# Altium schematic sheet FMC_connector_A.SchDoc
size A
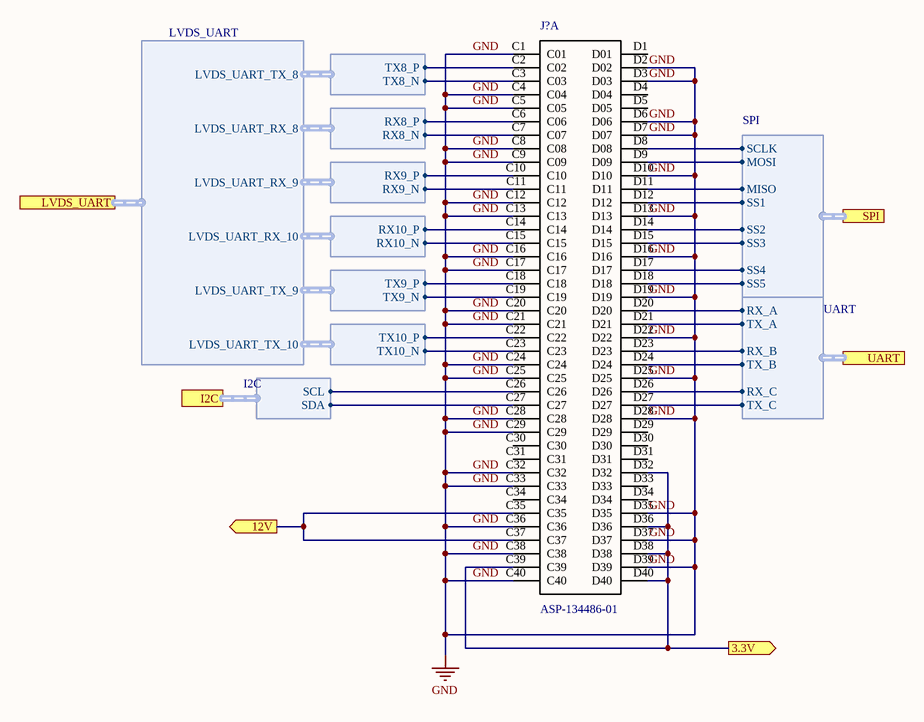
[diagram p0: FMC_connector_A.SchDoc]

## Parts
J?  ASP-134486-01  [*SAMTEC_ASP-134486-01_ASP-134486-01(Primary)]  (part A of 5)

## Ports
3.3V (out), 12V (out), I2C (harness I2C), LVDS_UART (harness LVDS_UART), SPI (harness SPI), UART (harness UART)

## Harnesses
I2C: SCL, SDA
SPI: SS1, SS2, MOSI, MISO, SCLK, SS3, SS4, SS5
UART: RX_A, TX_A, RX_B, TX_B, RX_C, TX_C
LVDS_UART_RX_8: RX8_P, RX8_N
LVDS_UART_RX_9: RX9_P, RX9_N
LVDS_UART_RX_10: RX10_P, RX10_N
LVDS_UART_TX_8: TX8_P, TX8_N
LVDS_UART_TX_9: TX9_P, TX9_N
LVDS_UART_TX_10: TX10_P, TX10_N
LVDS_UART: LVDS_UART_TX_8, LVDS_UART_RX_8, LVDS_UART_RX_9, LVDS_UART_RX_10, LVDS_UART_TX_9, LVDS_UART_TX_10

## Nets
GND: J?.C1(C01) J?.C4(C04) J?.C5(C05) J?.C8(C08) J?.C9(C09) J?.C12 J?.C13 J?.C16 J?.C17 J?.C20 J?.C21 J?.C24 J?.C25 J?.C28 J?.C29 J?.C32 J?.C33 J?.C36 J?.C38 J?.C40 J?.D2(D02) J?.D3(D03) J?.D6(D06) J?.D7(D07) J?.D10 J?.D13 J?.D16 J?.D19 J?.D22 J?.D25 J?.D28 J?.D35 J?.D37 J?.D39
3.3V: J?.C39 J?.D32 J?.D36 J?.D38 J?.D40 ; port 3.3V
12V: J?.C35 J?.C37 ; port 12V
NetJ?_C2: J?.C2(C02) ; harness LVDS_UART_TX_8.TX8_P
NetJ?_C3: J?.C3(C03) ; harness LVDS_UART_TX_8.TX8_N
NetJ?_C6: J?.C6(C06) ; harness LVDS_UART_RX_8.RX8_P
NetJ?_C7: J?.C7(C07) ; harness LVDS_UART_RX_8.RX8_N
NetJ?_C10: J?.C10 ; harness LVDS_UART_RX_9.RX9_P
NetJ?_C11: J?.C11 ; harness LVDS_UART_RX_9.RX9_N
NetJ?_C14: J?.C14 ; harness LVDS_UART_RX_10.RX10_P
NetJ?_C15: J?.C15 ; harness LVDS_UART_RX_10.RX10_N
NetJ?_C18: J?.C18 ; harness LVDS_UART_TX_9.TX9_P
NetJ?_C19: J?.C19 ; harness LVDS_UART_TX_9.TX9_N
NetJ?_C22: J?.C22 ; harness LVDS_UART_TX_10.TX10_P
NetJ?_C23: J?.C23 ; harness LVDS_UART_TX_10.TX10_N
NetJ?_C26: J?.C26 ; port I2C.SCL
NetJ?_C27: J?.C27 ; port I2C.SDA
NetJ?_D8: J?.D8(D08) ; port SPI.SCLK
NetJ?_D9: J?.D9(D09) ; port SPI.MOSI
NetJ?_D11: J?.D11 ; port SPI.MISO
NetJ?_D12: J?.D12 ; port SPI.SS1
NetJ?_D14: J?.D14 ; port SPI.SS2
NetJ?_D15: J?.D15 ; port SPI.SS3
NetJ?_D17: J?.D17 ; port SPI.SS4
NetJ?_D18: J?.D18 ; port SPI.SS5
NetJ?_D20: J?.D20 ; port UART.RX_A
NetJ?_D21: J?.D21 ; port UART.TX_A
NetJ?_D23: J?.D23 ; port UART.RX_B
NetJ?_D24: J?.D24 ; port UART.TX_B
NetJ?_D26: J?.D26 ; port UART.RX_C
NetJ?_D27: J?.D27 ; port UART.TX_C

Not connected (* = marked no-connect by the designer): J? C30 C31 C34 D1(D01) D4(D04) D5(D05) D29 D30 D31 D33 D34

## Library data of the parts
J? = ASP-134486-01: 400 Position Connector Array, Female Sockets Surface Mount Gold; MF: Samtec Inc.; MP: ASP-134486-01; Digi-Key_Purchase_URL: https://www.digikey.com/product-detail/en/samtec-inc/ASP-134486-01/SAM8728CT-ND/2135095?utm_source=snapeda&utm_medium=aggregator&utm_campaign=symbol; SnapEDA_Link: https://www.snapeda.com/parts/ASP-134486-01/Samtec%20Inc./view-part/898249/?ref=snap; Package: None; Digi-Key_Part_Number: SAM8728CT-ND; Value: *